# Altium schematic sheet USBInterface.SchDoc
size A4; Date: 07.06.2021; Author: Mateusz Mróz; CompanyName: AGH; DocumentNumber: 3; SheetNumber: 3; SheetTotal: 6
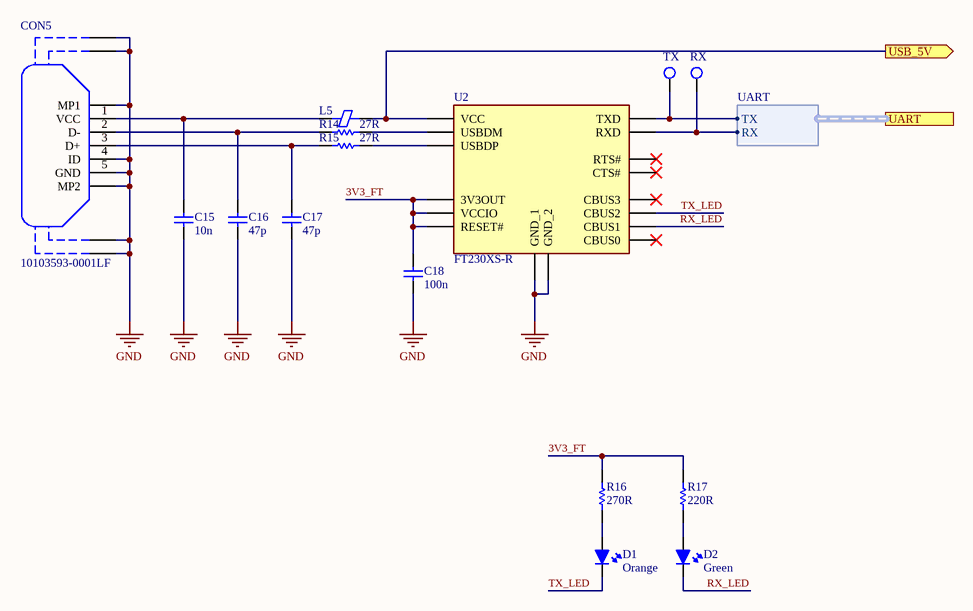
[diagram p0: USBInterface.SchDoc]

## Parts
C15  10n  [Cap_0603_MD_outline]
C16  47p  [Cap_0402_MD_outline]
C17  47p  [Cap_0402_MD_outline]
C18  100n  [Cap_0603_MD_outline]
CON5  10103593-0001LF  [101035930001LF]
D1  Orange  [LED_0805_OUTLINE]
D2  Green  [LED_0805_OUTLINE]
L5  (no value)  [Bead_0805_MD_outline]
R14  27R  [Res_0603_MD_outline]
R15  27R  [Res_0603_MD_outline]
R16  270R  [Res_0805_MD_outline]
R17  220R  [Res_0805_MD_outline]
TP8  TX  [TP_SQ25x40]  (no BOM)
TP9  RX  [TP_SQ25x40]  (no BOM)
U2  FT230XS-R  [SOP64P599X175-16N]

## Ports
UART (harness UART), USB_5V (out)

## Harnesses
UART: TX, RX

## Nets
GND: C15.1 C16.1 C17.1 C18.1 CON5.4(ID) CON5.5(GND) CON5.MH1 CON5.MH2 CON5.MH3 CON5.MH4 CON5.MP1 CON5.MP2 U2.5(GND_1) U2.13(GND_2)
3V3_FT: C18.2 R16.2 R17.2 U2.3(VCCIO) U2.10(3V3OUT) U2.11(RESET#)
RX_LED: D2.K U2.14(CBUS1)
TX_LED: D1.K U2.7(CBUS2)
USB_5V: L5.2 U2.12(VCC) ; port USB_5V
NetC15_2: C15.2 CON5.1(VCC) L5.1
NetC16_2: C16.2 CON5.2(D-) R14.1
NetC17_2: C17.2 CON5.3(D+) R15.1
NetD1_A: D1.A R16.1
NetD2_A: D2.A R17.1
NetR14_2: R14.2 U2.9(USBDM)
NetR15_2: R15.2 U2.8(USBDP)
NetTP8_1: TP8.1 U2.1(TXD) ; port UART.TX
NetTP9_1: TP9.1 U2.4(RXD) ; port UART.RX

Not connected (* = marked no-connect by the designer): U2 2(RTS#)* 6(CTS#)* 15(CBUS0)* 16(CBUS3)*

## Notes on the sheet
- University name:
- Degree course:
- 3th year electronics
- Date:
- Author:
- Student Index:
- Course:
- Checked by:
- PUE
- dr hab. inż. Cezary Worek, prof. AGH
- 305093
- Project name:
- Document name:
- Variant name:
- Sheet/all:
- /
- Version number:

## Library data of the parts
C15 = Capacitor: MPN: GRM188R72A103KA01; Value: 10n; Package: 0603
C16 C17 = Capacitor: MPN: VJ0402A470JXXCW1BC; Value: 47p; Package: 0402
C18 = Capacitor: MPN: GRM188R72A104KA35; Value: 100n; Package: 0603
CON5 = 10103593-0001LF: USB Connector; Manufacturer_Name: Amphenol; Datasheet Link: https://4donline.ihs.com/images/VipMasterIC/IC/FRCI/FRCIS73238/FRCIS73238-1.pdf?hkey=6D3A4C79FDBF58556ACFDE234799DDF0; Height: 3.24mm; MPN: 10103593-0001LF; Mouser Part Number: 649-10103593-0001LF; Mouser Price/Stock: https://www.mouser.co.uk/ProductDetail/Amphenol-FCI/10103593-0001LF/?qs=EnLMdcWnKAAYkpXwqGEfpw%3D%3D
D1 = LED: MPN: 599-0130-007F; Colour: Orange
D2 = LED: MPN: 599-0181-007F; Colour: Green
L5 = Bead: Ferrite bead; MPN: MPZ2012S601AT000
R14 R15 = Resistor: MPN: MCT06030C2709FP500; Value: 27R; Package: 0603
R16 = Resistor: MPN: RCS0805270RFKEA; Value: 270R; Package: 0805
R17 = Resistor: MPN: RCS0805220RFKEA; Value: 220R; Package: 0805
TP8 TP9 = TestPoint: Test point; HelpURL: *; MPN: *
  TP8: Value: TX
  TP9: Value: RX
U2 = FT230XS-R: USB converter; Manufacturer_Name: FTDI Chip; Datasheet Link: http://www.ftdichip.com/Support/Documents/DataSheets/ICs/DS_FT230X.pdf; Height: 1.753mm; MPN: FT230XS-R; Mouser Part Number: 895-FT230XS-R; Mouser Price/Stock: https://www.mouser.co.uk/ProductDetail/FTDI/FT230XS-R?qs=Gp1Yz1mis3XyCLeYOseSng%3D%3D; Arrow Part Number: FT230XS-R; Arrow Price/Stock: http://www.arrow.com/en/products/ft230xs-r/ftdi-chip